# EAGLE design FilamentBox (EAGLE 7.3.0)
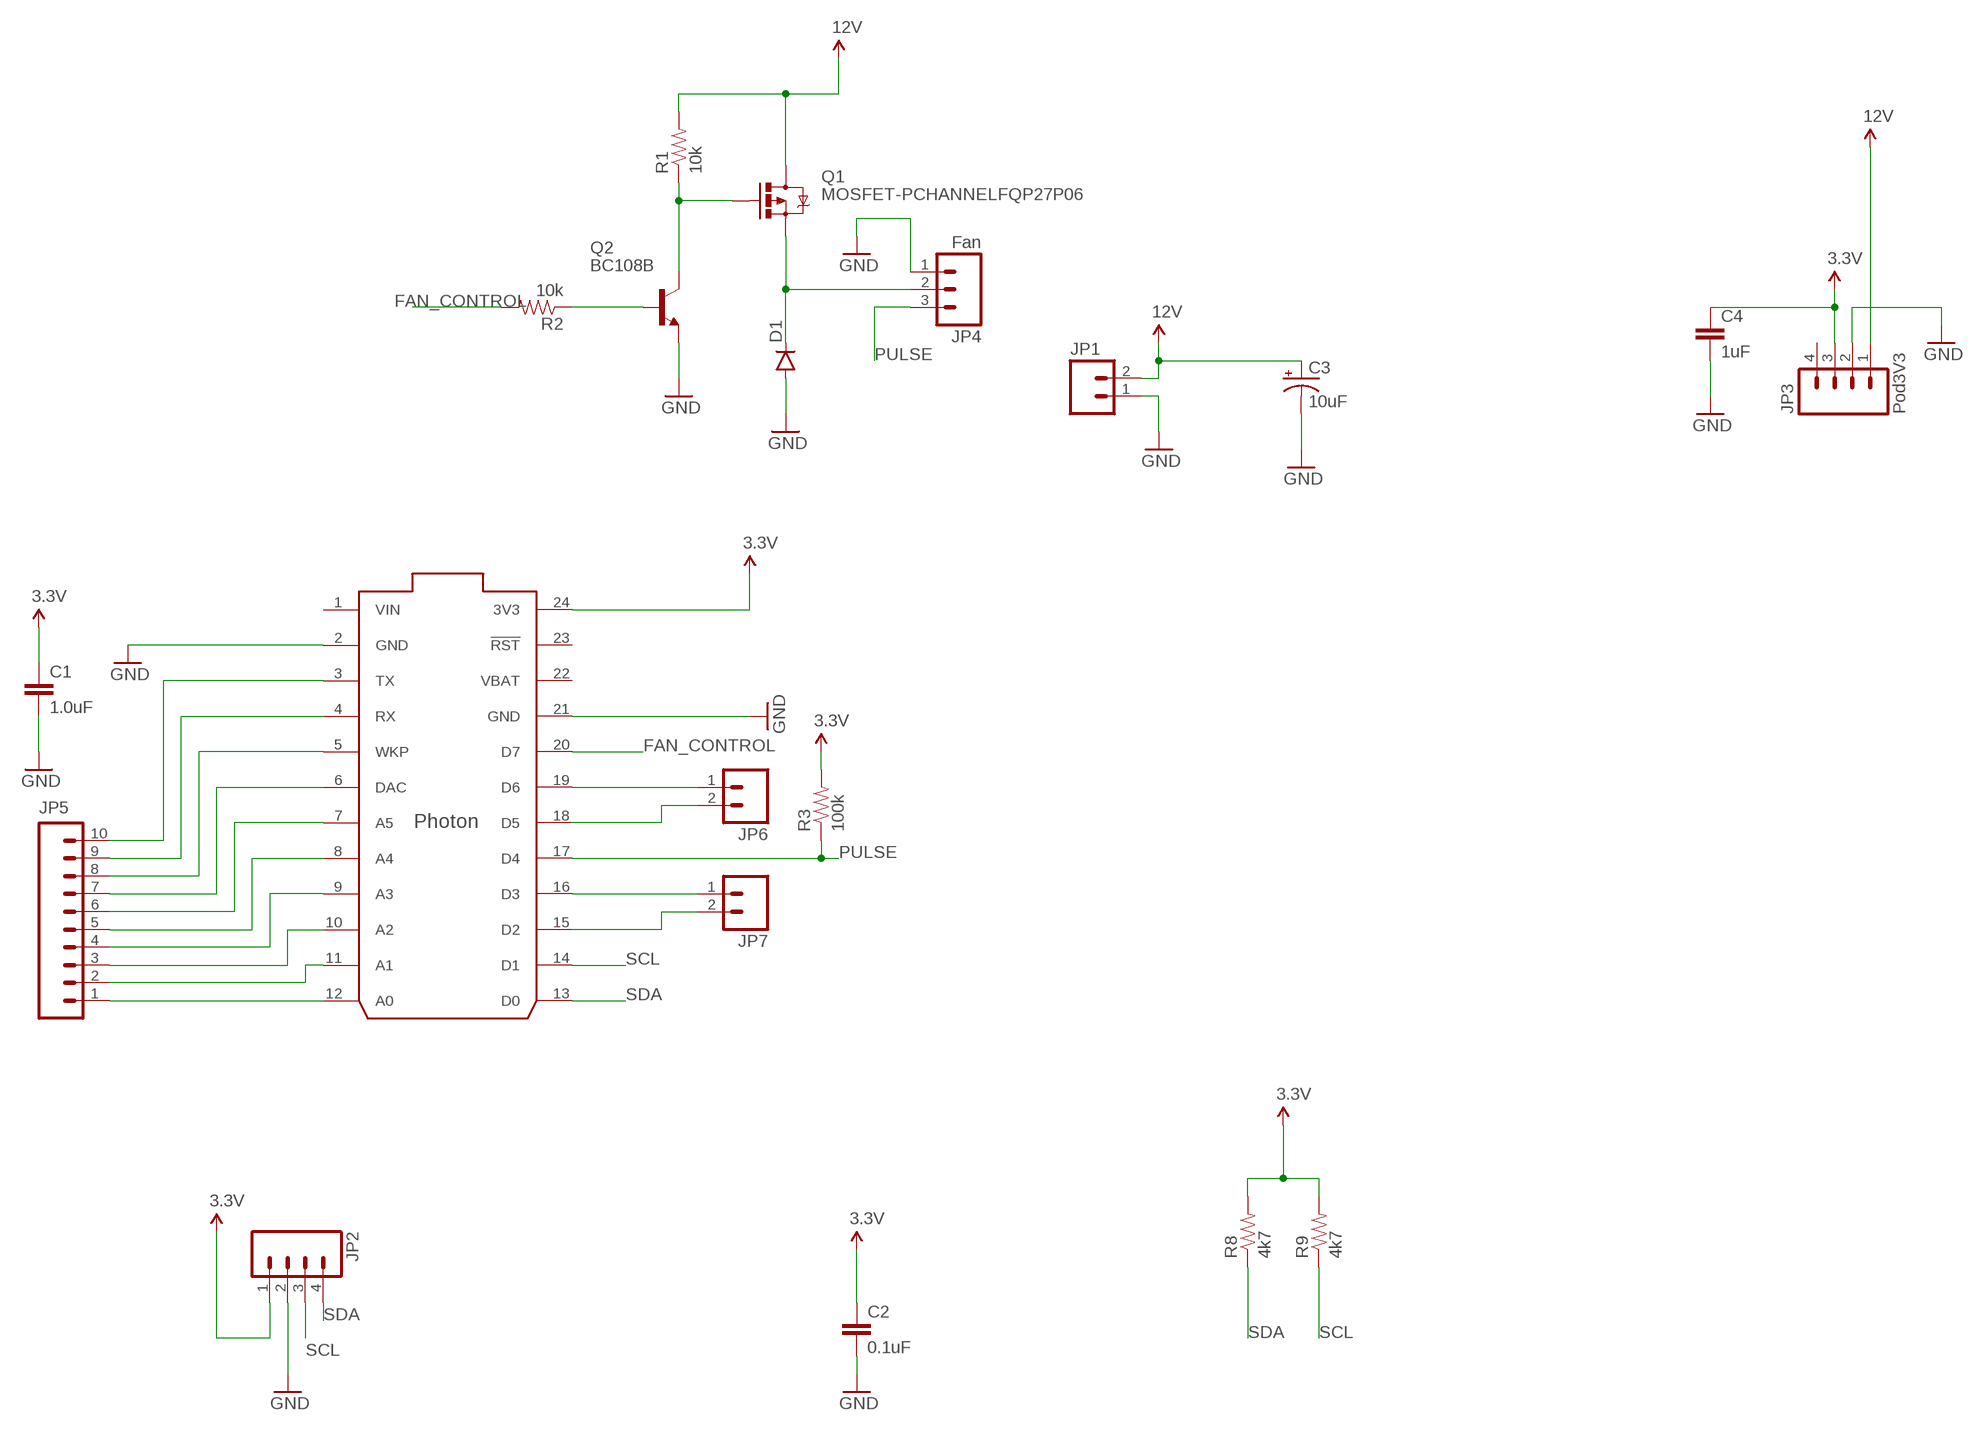
[diagram p0: schematic, sheet 1]

## Parts
C1  1.0uF  1.0UF-25V-+80/-20(0805)"  [0805-CAP]
C2  0.1uF  1.0UF-25V-+80/-20(0805)"  [0805-CAP]
C3  10uF  CAP_POLPTH2  [CPOL-RADIAL-10UF-25V]
C4  1uF  1UF-25V-10%(0805)"  [0805-CAP]
D1  DIODESOD123  [SOD-123]
JP1  M02JST-PTH-2  [JST-2-PTH]
JP2  M04PTH  [1X04]
JP3  Pod3V3  M04NO_SILK_ALL_ROUND  [1X04_NO_SILK_ALL_ROUND]
JP4  Fan  M03POLAR  [MOLEX-1X3]
JP5  M10NO_SILK_PTH_FEMALE  [1X10_NO_SILK]
JP6  M021X02_NO_SILK  [1X02_NO_SILK]
JP7  M021X02_NO_SILK  [1X02_NO_SILK]
Q1  MOSFET-PCHANNELFQP27P06  [TO220V]
Q2  BC108B  [TO18]
R1  10k  RESISTOR0805-RES  [0805]
R2  10k  RESISTOR0805-RES  [0805]
R3  100k  RESISTOR0805-RES  [0805]
R8  4k7  RESISTOR0805-RES  [0805]
R9  4k7  RESISTOR0805-RES  [0805]
U3  PHOTON  PHOTON_WITH_HEADERS  [PHOTON]

## Nets
3.3V: C1.1 C2.1 C4.1 JP2.1 JP3.3 R3.2 R8.2 R9.2 U3.24(3V3)
12V: C3.1(+) JP1.2 JP3.1 Q1.2(D) R1.2
FAN_CONTROL: R2.2 U3.20(D7)
GND: C1.2 C2.2 C3.2(-) C4.2 D1.A JP1.1 JP2.2 JP3.2 JP4.1 Q2.1(E) U3.2(GND) U3.21(GND)
N$1: JP5.1 U3.12(A0)
N$2: Q1.1(G) Q2.3(C) R1.1
N$3: JP5.2 U3.11(A1)
N$4: Q2.2(B) R2.1
N$5: JP5.3 U3.10(A2)
N$6: D1.C JP4.2 Q1.3(S)
N$7: JP5.4 U3.9(A3)
N$8: JP5.5 U3.8(A4)
N$9: JP5.6 U3.7(A5)
N$10: JP5.7 U3.6(DAC)
N$11: JP5.8 U3.5(WKP)
N$12: JP5.9 U3.4(RX)
N$13: JP5.10 U3.3(TX)
N$14: JP6.1 U3.19(D6)
N$15: JP6.2 U3.18(D5)
N$16: JP7.1 U3.16(D3)
N$17: JP7.2 U3.15(D2)
PULSE: JP4.3 R3.1 U3.17(D4)
SCL: JP2.3 R9.1 U3.14(D1)
SDA: JP2.4 R8.1 U3.13(D0)
Unconnected: JP3.4 U3.23(!RST)

## Power pins joined to a net without a drawn wire
VBAT: U3.22(VBAT)
VIN: U3.1(VIN)

## Library data of the parts
C1 = SparkFun-Capacitors:1.0UF-25V-+80/-20(0805): CAP-11625; PROD_ID: CAP-11625
C2 = SparkFun-Capacitors:1.0UF-25V-+80/-20(0805): CAP-11625; PROD_ID: CAP-11625; VALUE: 1.0uF
C3 = SparkFun-Capacitors:CAP_POL: Capacitor Polarized These are standard SMD and PTH capacitors. Normally 10uF, 47uF, and 100uF in electrolytic and tantalum varieties. Always verify the external diameter of the through hole cap, it varies with capacity, voltage, and manufacturer. The EIA devices should be standard.
C4 = SparkFun-Capacitors:1UF-25V-10%(0805): CAP-08064
D1 = SparkFun-DiscreteSemi:DIODE: Diode These are standard reverse protection diodes and small signal diodes. SMA package can handle up to about 1A. SOD-323 can handle about 200mA. What the SOD-323 package when ordering, there are some mfgs out there that are 5-pin packages.
JP1 = SparkFun-Connectors:M02: Standard 2-pin 0.1" header. Use with - straight break away headers ( PRT-00116) - right angle break away headers (PRT-00553) - swiss pins (PRT-00743) - machine pins (PRT-00117) - female headers (PRT-00115) Molex polarized connector foot print use with: PRT-08233 with associated crimp pins and housings. 2.54_SCREWTERM for use with PRT-10571. 3.5mm Screw Terminal footprints for PRT-08084 5mm Screw Terminal footprints for use with PRT-08432; PROD_ID: CONN-09863; SKU: PRT-09914
JP2 JP3 = SparkFun-Connectors:M04: Header 4 Standard 4-pin 0.1" header. Use with straight break away headers (SKU : PRT-00116), right angle break away headers (PRT-00553), swiss pins (PRT-00743), machine pins (PRT-00117), and female headers (PRT-00115). Molex polarized connector foot print use with SKU : PRT-08231 with associated crimp pins and housings. 1MM SMD Version SKU: PRT-10208
JP4 = SparkFun-Connectors:M03: Header 3 Standard 3-pin 0.1" header. Use with straight break away headers (SKU : PRT-00116), right angle break away headers (PRT-00553), swiss pins (PRT-00743), machine pins (PRT-00117), and female headers (PRT-00115). Molex polarized connector foot print use with SKU : PRT-08232 with associated crimp pins and housings.
JP5 = SparkFun-Connectors:M10: Header 10 Standard 10-pin 0.1" header. Use with straight break away headers (SKU : PRT-00116), right angle break away headers (PRT-00553), swiss pins (PRT-00743), machine pins (PRT-00117), and female headers (PRT-00115).; PROD_ID: CONN-11563
JP6 JP7 = SparkFun-Connectors:M02: Standard 2-pin 0.1" header. Use with - straight break away headers ( PRT-00116) - right angle break away headers (PRT-00553) - swiss pins (PRT-00743) - machine pins (PRT-00117) - female headers (PRT-00115) Molex polarized connector foot print use with: PRT-08233 with associated crimp pins and housings. 2.54_SCREWTERM for use with PRT-10571. 3.5mm Screw Terminal footprints for PRT-08084 5mm Screw Terminal footprints for use with PRT-08432
Q1 = SparkFun-DiscreteSemi:MOSFET-PCHANNEL: Generic PMOSFET IRLML2244 - TRANS-11153 (SOT-23 -20V -4.3A) (1.Gate 2.Source 3.Drain) FQP27P06 - COM-10349 <http://www.sparkfun.com/products/10349> (TO-220 -60V -27A) (1.Gate 2.Source 3.Drain)
Q2 = transistor-npn:BC108B: NPN Transistor
R1-R3 R8 R9 = SparkFun-Resistors:RESISTOR: Resistor Basic schematic elements and footprints for 0603, 1206, and PTH resistors.
U3 = Spark:PHOTON

## Board
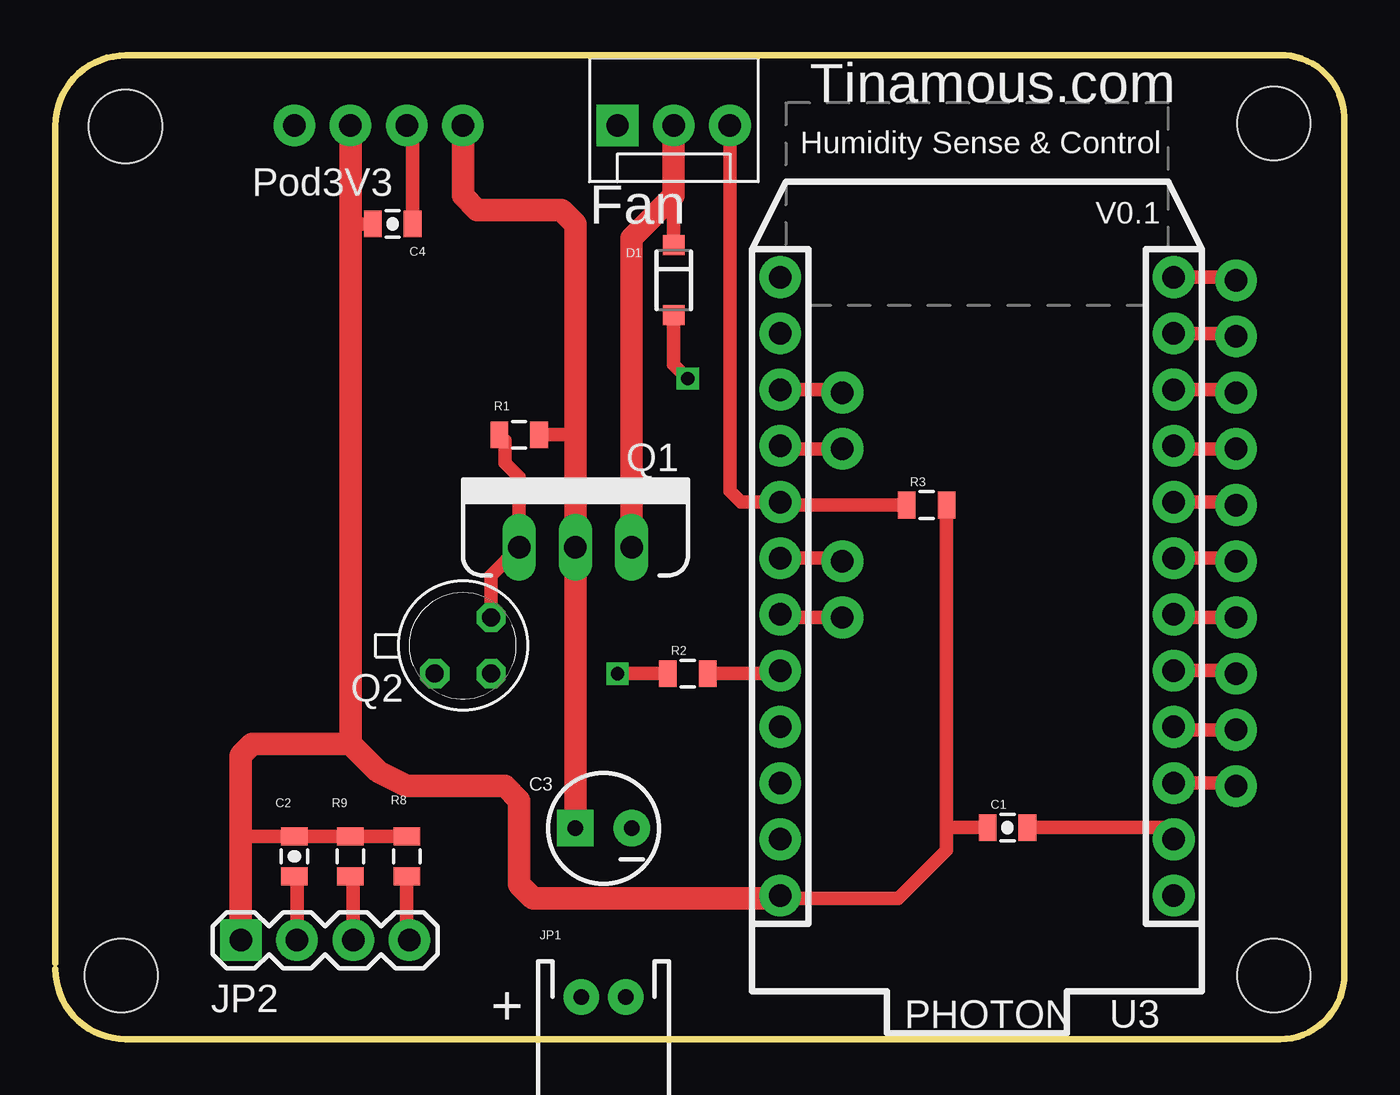
[diagram p1: board, top side]
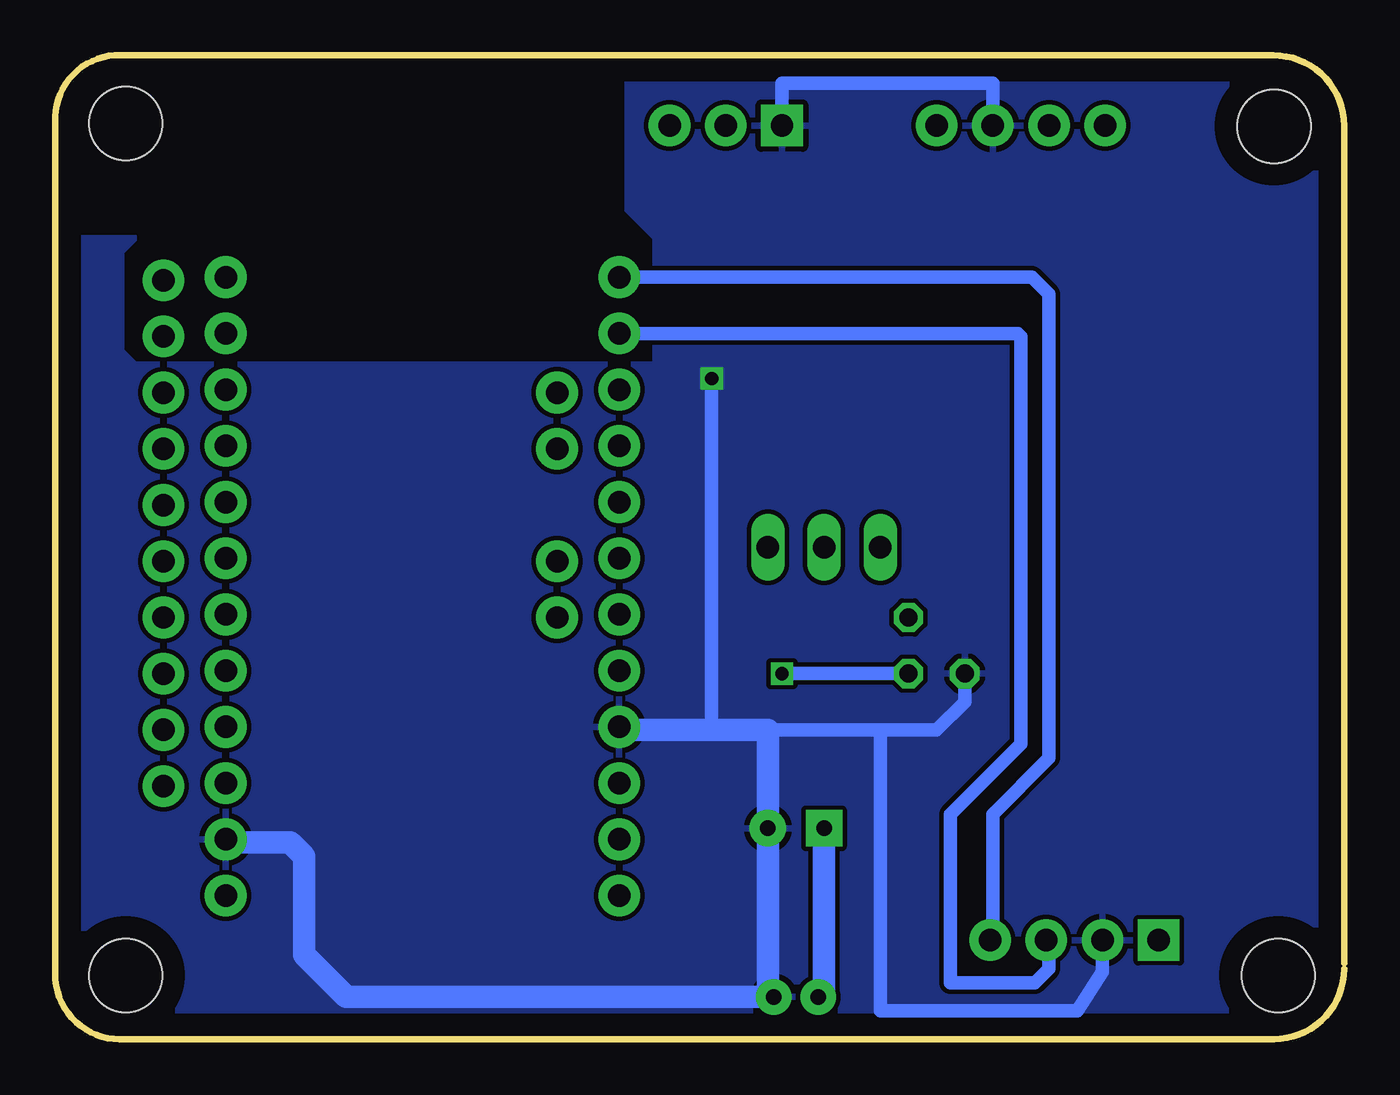
[diagram p2: board, bottom side, seen from below]

Size 58.23 x 44.46 mm. Coordinates in mm from the lower left corner, seen from the top.
Outline: 0,3.19 arc90 3.17,0.01 55.05,0.01 arc90 58.23,2.69 58.23,41.42 arc90 55.55,44.46 3.19,44.46 arc90 0,41.29 0,3.44
Copper layers (1*16): Top 0.035mm / dielectric 1.5mm / Bottom 0.035mm
Design rules "default": minimum track width 10mil, minimum drill 24mil, track to track 8mil, track to pad 8mil, pad to pad 8mil, via to via 8mil, smd to smd 8mil, copper to edge 40mil, drill to drill 8mil, minimum pad ring 10mil, minimum via ring 8mil, stop-mask expansion 4mil, vias tented up to drill 0mil, thermal gap 10mil

### Footprints (pad centres in the part's own frame; a part is rotated, then mirrored left to right if it is on the bottom)
0805-CAP = smd 0.8 x 1.2: 1 -0.9,0; 2 0.9,0
CPOL-RADIAL-10UF-25V = drill 0.7 pad 1.651 square: 1 1.27,0 | drill 0.7 pad 1.651: 2 -1.27,0
SOD-123 = smd 0.9 x 0.95: A 1.575,0; C -1.575,0
JST-2-PTH = drill 0.7 pad 1.6: 1 -1,0; 2 1,0
1X04 = drill 1.016 pad 1.88 square: 1 0,0 | drill 1.016 pad 1.88: 2 2.54,0; 3 5.08,0; 4 7.62,0
1X04_NO_SILK_ALL_ROUND = drill 1.016 pad 1.88: 1 0,0; 2 2.54,0; 3 5.08,0; 4 7.62,0
MOLEX-1X3 = drill 1.016 pad 1.88 square: 1 0,0 | drill 1.016 pad 1.88: 2 2.54,0; 3 5.08,0
1X10_NO_SILK = drill 1.016 pad 1.88: 1 0,0; 2 2.54,0; 3 5.08,0; 4 7.62,0; 5 10.16,0; 6 12.7,0; 7 15.24,0; 8 17.78,0; 9 20.32,0; 10 22.86,0
1X02_NO_SILK = drill 1.016 pad 1.88: 1 0,0; 2 2.54,0
TO220V = drill 1.016 long: 1 -2.54,0; 2 0,0; 3 2.54,0
TO18 = drill 0.813 octagon: 1 -1.27,-1.27; 2 1.27,-1.27; 3 1.27,1.27
0805 = smd 0.8 x 1.2: 1 -0.9,0; 2 0.9,0
PHOTON = drill 1.016 pad 1.88: 1 1.27,32.258; 2 1.27,29.718; 3 1.27,27.178; 4 1.27,24.638; 5 1.27,22.098; 6 1.27,19.558; 7 1.27,17.018; 8 1.27,14.478; 9 1.27,11.938; 10 1.27,9.398; 11 1.27,6.858; 12 1.27,4.318; 13 19.05,4.318; 14 19.05,6.858; 15 19.05,9.398; 16 19.05,11.938; 17 19.05,14.478; 18 19.05,17.018; 19 19.05,19.558; 20 19.05,22.098; 21 19.05,24.638; 22 19.05,27.178; 23 19.05,29.718; 24 19.05,32.258
STAND-OFF = hole 3.302: 0,0

### Placement (x,y rotation side)
C1  43.02,9.57 0 top
C2  10.79,8.27 270 top
C3  24.77,9.54 180 top
C4  15.24,36.84 0 top
D1  27.94,34.3 270 top
JP1  24.77,1.92 180 top
JP2  8.38,4.48 0 top
JP3  18.41,41.29 180 top
JP4  25.4,41.29 0 top
JP5  53.34,34.3 270 top
JP6  35.56,19.06 90 top
JP7  35.56,26.68 90 top
Q1  23.5,22.24 0 top
Q2  18.41,17.79 0 top
R1  20.95,27.32 0 top
R2  28.57,16.52 0 top
R3  39.37,24.14 0 top
R8  15.88,8.27 90 top
R9  13.34,8.27 90 top
U3  51.8,38.75 180 top
U$1  [STAND-OFF]  2.98,2.89 0 top
U$2  [STAND-OFF]  55.05,2.89 0 top
U$3  [STAND-OFF]  55.05,41.38 0 top
U$4  [STAND-OFF]  3.17,41.25 0 top

### Tracks (layer width: path | path; a pad name or v marks a point on that pad's centre or on a via)
3.3V
  Top 0.61: R3.2 40.27,9.54 | 40.27,9.54 40.27,8.53 38.1,6.36 32.89,6.36 U3.24 | C1.1 40.3,9.57 40.27,9.54 | C4.1 13.34,36.84 | 8.38,8.9 8.64,9.17 C2.1 R9.2 R8.2
  Top 1.016: JP3.3 13.34,36.84 13.34,13.35 | 13.34,13.35 14.61,12.08 15.88,11.44 20.32,11.44 20.95,10.81 20.95,7 21.59,6.36 32.62,6.36 U3.24 33.02,6.23 | JP2.1 8.38,8.9 8.38,12.84 8.89,13.35 13.34,13.35
12V
  Top 0.61: R1.2 23.5,27.32
  Top 1.016: JP3.1 18.41,38.11 19.05,37.48 22.86,37.48 23.5,36.84 23.5,27.32 Q1.2 C3.1
  Bottom 1.016: C3.1 23.5,2.19 JP1.2
FAN_CONTROL
  Top 0.61: R2.2 32.62,16.52 U3.20
GND  (via drill 0.6)
  Top 0.61: C1.2 50,9.57 U3.2 | C4.2 16.14,41.02 JP3.2 | JP2.2 10.92,7.24 C2.2 | D1.A 27.94,30.49 v28.57,29.86
  Bottom 0.61: Q2.1 17.14,15.25 18.41,13.98 20.95,13.98 | 20.95,13.98 26.04,13.98 | JP2.2 10.92,3.06 12.06,1.28 20.95,1.28 20.95,13.98 | v28.57,29.86 28.57,13.98 | JP3.2 15.88,43.19 25.4,43.19 JP4.1 | 50.67,8.9 U3.2
  Bottom 1.016: U3.2 50.4,8.9 47.62,8.9 46.99,8.27 46.99,3.82 45.09,1.92 JP1.1 26.04,2.19 C3.2 26.04,13.98 28.57,13.98 32.62,13.98 U3.21
  pour Bottom: 57.78,36.21 57.78,1.92 56.52,0.65 2.54,0.65 0.64,2.55 0.64,41.92 2.54,43.83 32.38,43.83 32.38,37.48 31.11,36.21 31.11,30.49 54.61,30.49 55.24,31.13 55.24,35.57 54.61,36.21
N$1
  Top 0.61: U3.12 53.2,34.44 JP5.1
N$2
  Top 0.305: 20.32,27.05 R1.1
  Top 0.61: 20.32,27.05 20.32,26.05 20.95,25.41 Q1.1 19.68,20.97 Q2.3
N$3
  Top 0.61: U3.11 53.2,31.9 JP5.2
N$4  (via drill 0.6)
  Top 0.61: v25.4,16.52 R2.1
  Bottom 0.61: Q2.2 v25.4,16.52
N$5
  Top 0.61: U3.10 53.2,29.36 JP5.3
N$6
  Top 0.61: D1.C 27.94,38.75
  Top 1.016: Q1.3 26.04,36.21 27.94,38.11 27.94,38.75 JP4.2
N$7
  Top 0.61: JP5.4 50.67,26.68 U3.9
N$8
  Top 0.61: U3.8 53.2,24.28 JP5.5
N$9
  Top 0.61: U3.7 53.2,21.74 JP5.6
N$10
  Top 0.61: JP5.7 50.67,19.06 U3.6
N$11
  Top 0.61: U3.5 53.2,16.66 JP5.8
N$12
  Top 0.61: JP5.9 50.67,13.98 U3.4
N$13
  Top 0.61: U3.3 53.2,11.58 JP5.10
N$14
  Top 0.61: JP6.1 32.89,19.06 U3.19
N$15
  Top 0.61: U3.18 35.42,21.74 JP6.2
N$16
  Top 0.61: JP7.1 32.89,26.68 U3.16
N$17
  Top 0.61: U3.15 35.42,29.36 JP7.2
PULSE
  Top 0.61: JP4.3 30.48,24.78 30.98,24.28 U3.17 32.89,24.14 R3.1
SCL
  Top 0.61: JP2.3 13.46,7.24 R9.1
  Bottom 0.61: U3.14 14.74,31.9 14.61,31.76 14.61,13.35 17.78,10.17 17.78,2.55 13.97,2.55 13.34,3.19 13.34,4.35 JP2.3
SDA
  Top 0.61: R8.1 15.88,4.6 JP2.4
  Bottom 0.61: U3.13 14.11,34.44 13.34,33.67 13.34,12.71 15.88,10.17 15.88,4.6 JP2.4

### Text on the board
tNames: Tinamous.com | Humidity Sense & Control | Fan | V0.1 | +